# Altium schematic sheet µC.SchDoc
size A
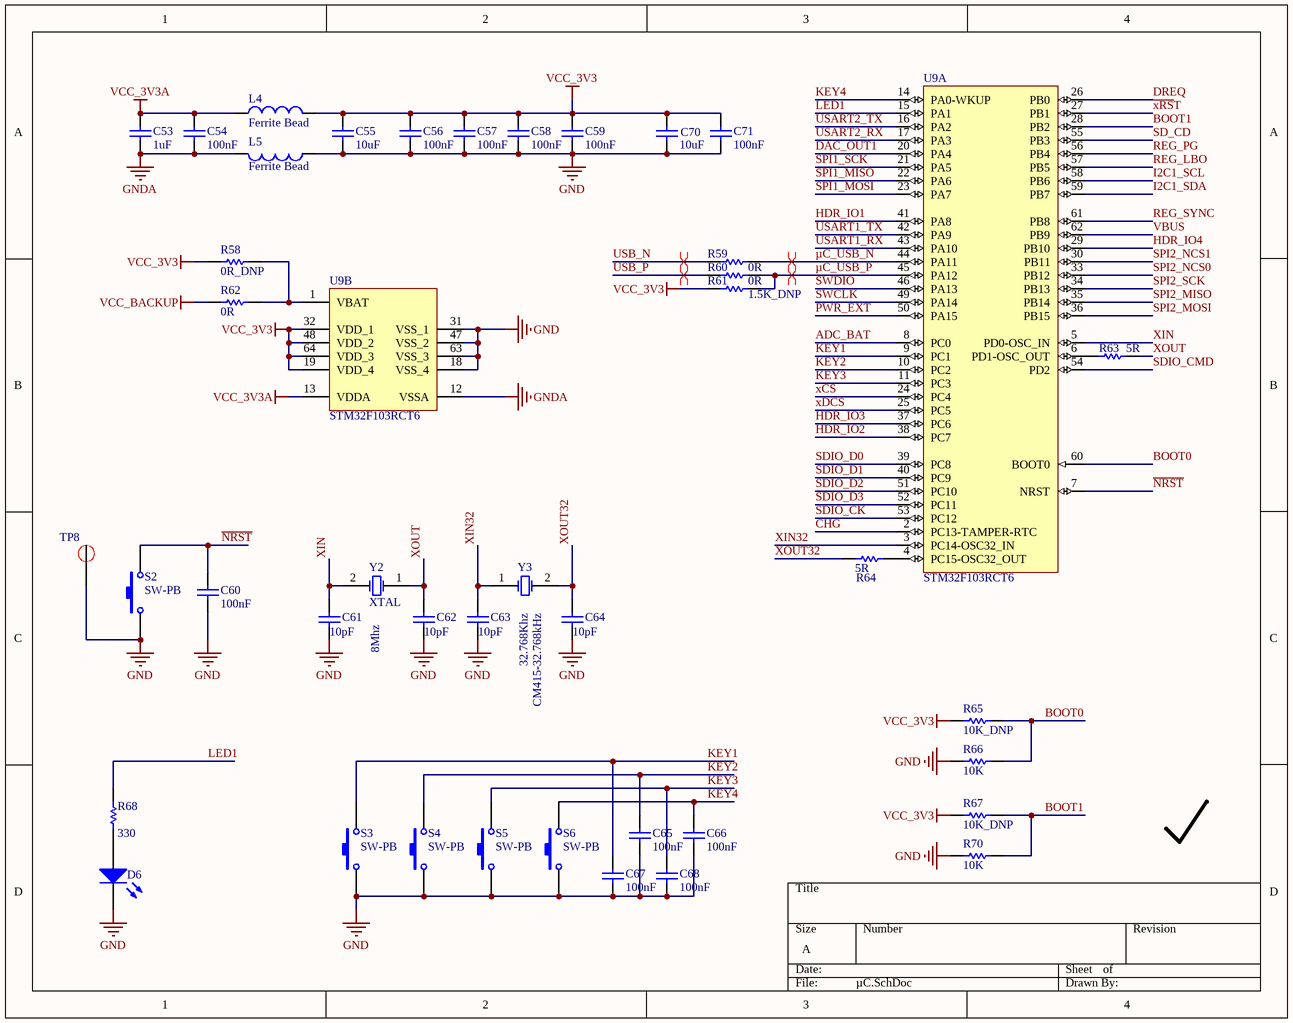
[diagram p0: µC.SchDoc]

## Parts
C53  value 1uF  [0603PKG]  (hidden comment: Cap Semi)
C54  value 100nF  [0603PKG]  (hidden comment: Cap Semi)
C55  value 10uF  [0603PKG]  (hidden comment: Cap Semi)
C56  value 100nF  [0603PKG]  (hidden comment: Cap Semi)
C57  value 100nF  [0603PKG]  (hidden comment: Cap Semi)
C58  value 100nF  [0603PKG]  (hidden comment: Cap Semi)
C59  value 100nF  [0603PKG]  (hidden comment: Cap Semi)
C60  value 100nF  [0603PKG]  (hidden comment: Cap Semi)
C61  value 10pF  [0603PKG]  (hidden comment: Cap)
C62  value 10pF  [0603PKG]  (hidden comment: Cap)
C63  value 10pF  [0603PKG]  (hidden comment: Cap)
C64  value 10pF  [0603PKG]  (hidden comment: Cap)
C65  value 100nF  [0603PKG]  (hidden comment: Cap Semi)
C66  value 100nF  [0603PKG]  (hidden comment: Cap Semi)
C67  value 100nF  [0603PKG]  (hidden comment: Cap Semi)
C68  value 100nF  [0603PKG]  (hidden comment: Cap Semi)
C70  value 10uF  [C0805]  (hidden comment: Cap Semi)
C71  value 100nF  [C0805]  (hidden comment: Cap Semi)
D6  LED0  [C0805]  (value not drawn)
L4  Ferrite Bead  [C0805]
L5  Ferrite Bead  [C0805]
R58  value 0R_DNP  [0603PKG]  (hidden comment: Res1)
R59  value 0R  [0603PKG]  (hidden comment: Res1)
R60  value 0R  [0603PKG]  (hidden comment: Res1)
R61  value 1.5K_DNP  [0603PKG]  (hidden comment: Res1)
R62  value 0R  [0603PKG]  (hidden comment: Res1)
R63  value 5R  [0603PKG]  (hidden comment: Res1)
R64  value 5R  [0603PKG]  (hidden comment: Res1)
R65  value 10K_DNP  [0603PKG]  (hidden comment: Res1)
R66  value 10K  [0603PKG]  (hidden comment: Res1)
R67  value 10K_DNP  [0603PKG]  (hidden comment: Res1)
R68  value 330  [0603PKG]  (hidden comment: Res Semi)
R70  value 10K  [0603PKG]  (hidden comment: Res1)
S2  SW-PB  [SMD push button]
S3  SW-PB  [SMD push button]
S4  SW-PB  [SMD push button]
S5  SW-PB  [SMD push button]
S6  SW-PB  [SMD push button]
TP8  TP  [TP_15]  (value not drawn)
U9  STM32F103RCT6  [LQFP64]  (parts A,B of 2)
Y2  XTAL  value 8Mhz  [SMD_Crystal]
Y3  CM415-32.768kHz  value 32.768Khz  [CM415]

## Nets
GND: C55.1 C56.1 C57.1 C58.1 C59.1 C60.1 C61.1 C62.1 C63.1 C64.1 C65.1 C66.1 C67.1 C68.1 C70.1 C71.1 D6.2(K) L5.1 R66.2 R70.2 S2.1 S3.1 S4.1 S5.1 S6.1 TP8.1 U9.18(VSS_4) U9.31(VSS_1) U9.47(VSS_2) U9.63(VSS_3)
GNDA: C53.1 C54.1 L5.2 U9.12(VSSA)
VCC_3V3: C55.2 C56.2 C57.2 C58.2 C59.2 C70.2 C71.2 L4.2 R58.2 R61.2 R65.2 R67.2 U9.19(VDD_4) U9.32(VDD_1) U9.48(VDD_2) U9.64(VDD_3)
VCC_3V3A: C53.2 C54.2 L4.1 U9.13(VDDA)
VCC_BACKUP: R62.2
ADC_BAT: U9.8(PC0)
BOOT0: R65.1 R66.1 U9.60(BOOT0)
BOOT1: R67.1 R70.1 U9.28(PB2)
~{CHG}: U9.2(PC13-TAMPER-RTC)
DAC_OUT1: U9.20(PA4)
DREQ: U9.26(PB0)
HDR_IO1: U9.41(PA8)
HDR_IO2: U9.38(PC7)
HDR_IO3: U9.37(PC6)
HDR_IO4: U9.29(PB10)
I2C1_SCL: U9.58(PB6)
I2C1_SDA: U9.59(PB7)
KEY1: C67.2 S3.2 U9.9(PC1)
KEY2: C65.2 S4.2 U9.10(PC2)
KEY3: C68.2 S5.2 U9.11(PC3)
KEY4: C66.2 S6.2 U9.14(PA0-WKUP)
LED1: R68.2 U9.15(PA1)
~{NRST}: C60.2 S2.2 U9.7(NRST)
PWR_EXT: U9.50(PA15)
REG_LBO: U9.57(PB5)
REG_PG: U9.56(PB4)
REG_SYNC: U9.61(PB8)
SD_CD: U9.55(PB3)
SDIO_CK: U9.53(PC12)
SDIO_CMD: U9.54(PD2)
SDIO_D0: U9.39(PC8)
SDIO_D1: U9.40(PC9)
SDIO_D2: U9.51(PC10)
SDIO_D3: U9.52(PC11)
SPI1_MISO: U9.22(PA6)
SPI1_MOSI: U9.23(PA7)
SPI1_SCK: U9.21(PA5)
SPI2_MISO: U9.35(PB14)
SPI2_MOSI: U9.36(PB15)
SPI2_NCS0: U9.33(PB12)
SPI2_NCS1: U9.30(PB11)
SPI2_SCK: U9.34(PB13)
SWCLK: U9.49(PA14)
SWDIO: U9.46(PA13)
USART1_RX: U9.43(PA10)
USART1_TX: U9.42(PA9)
USART2_RX: U9.17(PA3)
USART2_TX: U9.16(PA2)
USB_N: R59.2
USB_P: R60.2
VBUS: U9.62(PB9)
~{xCS}: U9.24(PC4)
~{xDCS}: U9.25(PC5)
~{xRS}T: U9.27(PB1)
XIN: C61.2 U9.5(PD0-OSC_IN) Y2.2(OSC2)
XIN32: C63.2 U9.3(PC14-OSC32_IN) Y3.1(OSC1)
XOUT: C62.2 R63.1 Y2.1(OSC1)
XOUT32: C64.2 R64.2 Y3.2(OSC2)
µC_USB_N: R59.1 U9.44(PA11)
µC_USB_P: R60.1 R61.1 U9.45(PA12)
NetD6_1: D6.1(A) R68.1
NetR58_1: R58.1 R62.1 U9.1(VBAT)
NetR63_2: R63.2 U9.6(PD1-OSC_OUT)
NetR64_1: R64.1 U9.4(PC15-OSC32_OUT)

## Layout directives
differential pair: USB_N, USB_P, µC_USB_N, µC_USB_P

## Library data of the parts
C53-C60 C65-C68 C70 C71 = Cap Semi: Capacitor (Semiconductor SIM Model); Published: 8-Jun-2000; LatestRevisionDate: 29-May-2009; LatestRevisionNote: IPC-7351 Footprint Added.; PackageReference: C1206; Publisher: Altium Limited; PackageDescription: Chip Capacitor
C61-C64 = Cap: Capacitor; Published: 8-Jun-2000; LatestRevisionDate: 17-Jul-2002; LatestRevisionNote: Re-released for DXP Platform.; PackageReference: RAD-0.3; Publisher: Altium Limited; PackageDescription: Radial Cap, Thru-Hole; 2 Leads; 0.3 in Pin Spacing
D6 = LED0: Typical INFRARED GaAs LED; Published: 8-Jun-2000; LatestRevisionDate: 08-Jul-2005; LatestRevisionNote: Mech Layer 1 removed.; PackageReference: LED-0; Publisher: Altium Limited; PackageDescription: LED; 2 Leads
L4 L5 = Inductor: Code_IEC: 1005; Value: 10mH; Published: 8-Jun-2000; LatestRevisionDate: 29-May-2009; LatestRevisionNote: IPC-7351 Footprint Added.; PackageReference: 0402-A; Publisher: Altium Limited; PackageDescription: Chip Inductor; Code_JEITA: 0402
R58-R67 R70 = Res1: Resistor; Published: 8-Jun-2000; LatestRevisionDate: 17-Jul-2002; LatestRevisionNote: Re-released for DXP Platform.; PackageReference: AXIAL-0.3; Publisher: Altium Limited; PackageDescription: Axial Device, Thru-Hole; 2 Leads; 0.3 in Pin Spacing
R68 = Res Semi: Semiconductor Resistor; Published: 8-Jun-2000; LatestRevisionDate: 17-Jul-2002; LatestRevisionNote: Re-released for DXP Platform.; PackageReference: AXIAL-0.5; Publisher: Altium Limited; PackageDescription: Axial Device, Thru-Hole; 2 Leads; 0.5 in Pin Spacing
S2-S6 = SW-PB: Switch; Published: 24-Mar-1999; LatestRevisionDate: 17-Jul-2002; LatestRevisionNote: Re-released for DXP Platform.; PackageReference: SPST-2; Publisher: Altium Limited; PackageDescription: Switch; 2 Leads
TP8 = Test Point
U9 = STM32F103RCT6: ARM Cortex-M3 32-bit MCU, 256 KB Flash, 48 KB Internal RAM, 51 I/Os, 64-pin LQFP, -40 to 85 degC, Tray; A/D Converter: 3x12-bit (16 Channel); D/A Converter: 2x12-bit (2 Channel); FLASH Size (Prog) (kB): 256; I/Os (High Current): 51; Internal RAM Size (kB): 48; Operating Frequency(F) (Processor speed) (MHz): 72; Supply Voltage(Vcc) min (V): 2; DatasheetVersion: Rev. 8; PackageVersion: Rev. 4, 06/2013; PackageReference: LQFP64; PackageDescription: 64-Pin Low Profile Quad Flat Package, 10 x 10 mm Body, 0.5 mm Pitch; Supplier 1: Digi-Key; Supplier Part Number 1: 497-9033-ND; Supplier 2: Newark; Supplier Part Number 2: 01P4099; Supplier 3: Newark; Supplier Part Number 3: 57P1227; Supplier 4: Mouser; Supplier Part Number 4: 511-STM32F103RCT6; Core: ARM Cortex-M3; Packing: Tray; Mounting Technology: Surface Mount; PartNumber: STM32F103RCT6; ComponentLink1Description: Manufacturer URL; ComponentLink1URL: http://www.st.com/web/en/home.html; ComponentLink2Description: Datasheet; ComponentLink2URL: http://www.st.com/st-web-ui/static/active/en/resource/technical/document/datasheet/CD00191185.pdf; ComponentLink3Description: Package Specification; ComponentLink3URL: http://www.st.com/st-web-ui/static/active/en/resource/technical/document/datasheet/DM00037051.pdf
Y2 = XTAL: Crystal Oscillator; Published: 8-Jun-2000; LatestRevisionDate: 17-Jul-2002; LatestRevisionNote: Re-released for DXP Platform.; PackageReference: R38; Publisher: Altium Limited; PackageDescription: Crystal, Thru-Hole; 2 Leads; Body 3.1 x 8.2 mm (Dia.xH)
Y3 = XTAL: Crystal Oscillator CM415-32.768kHz; Published: 8-Jun-2000; LatestRevisionDate: 17-Jul-2002; LatestRevisionNote: Re-released for DXP Platform.; PackageReference: R38; Publisher: Altium Limited; PackageDescription: Crystal, Thru-Hole; 2 Leads; Body 3.1 x 8.2 mm (Dia.xH)